# Altium schematic sheet STM32H733_PINOUT.SchDoc
size D; SheetNumber: 3; SheetTotal: 5
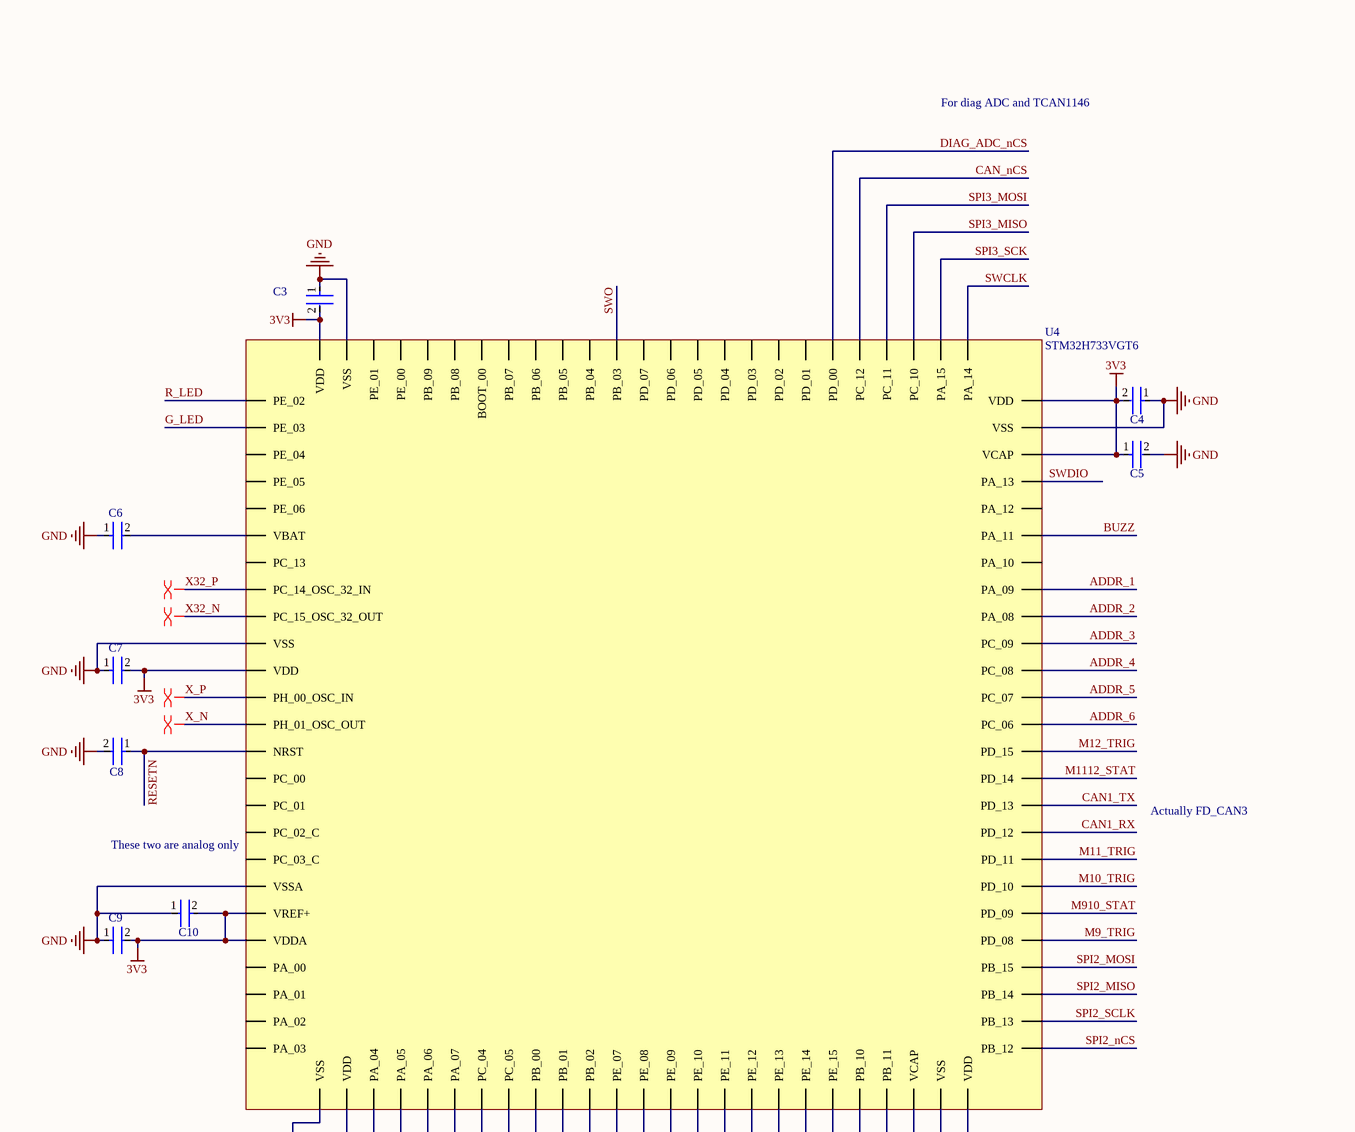
[diagram p0: STM32H733_PINOUT.SchDoc, top left]
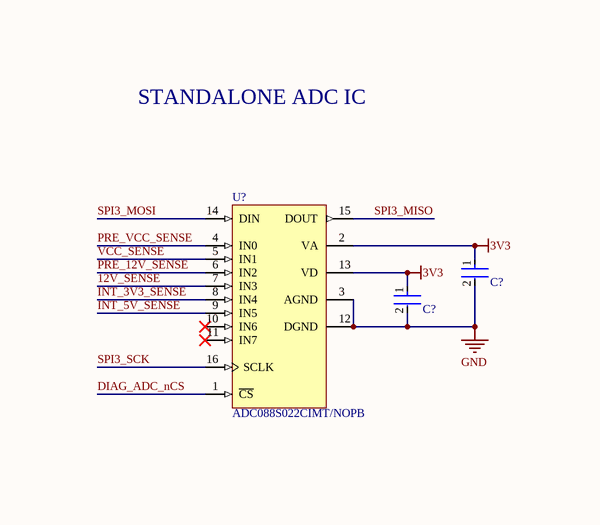
[diagram p1: STM32H733_PINOUT.SchDoc, top middle]
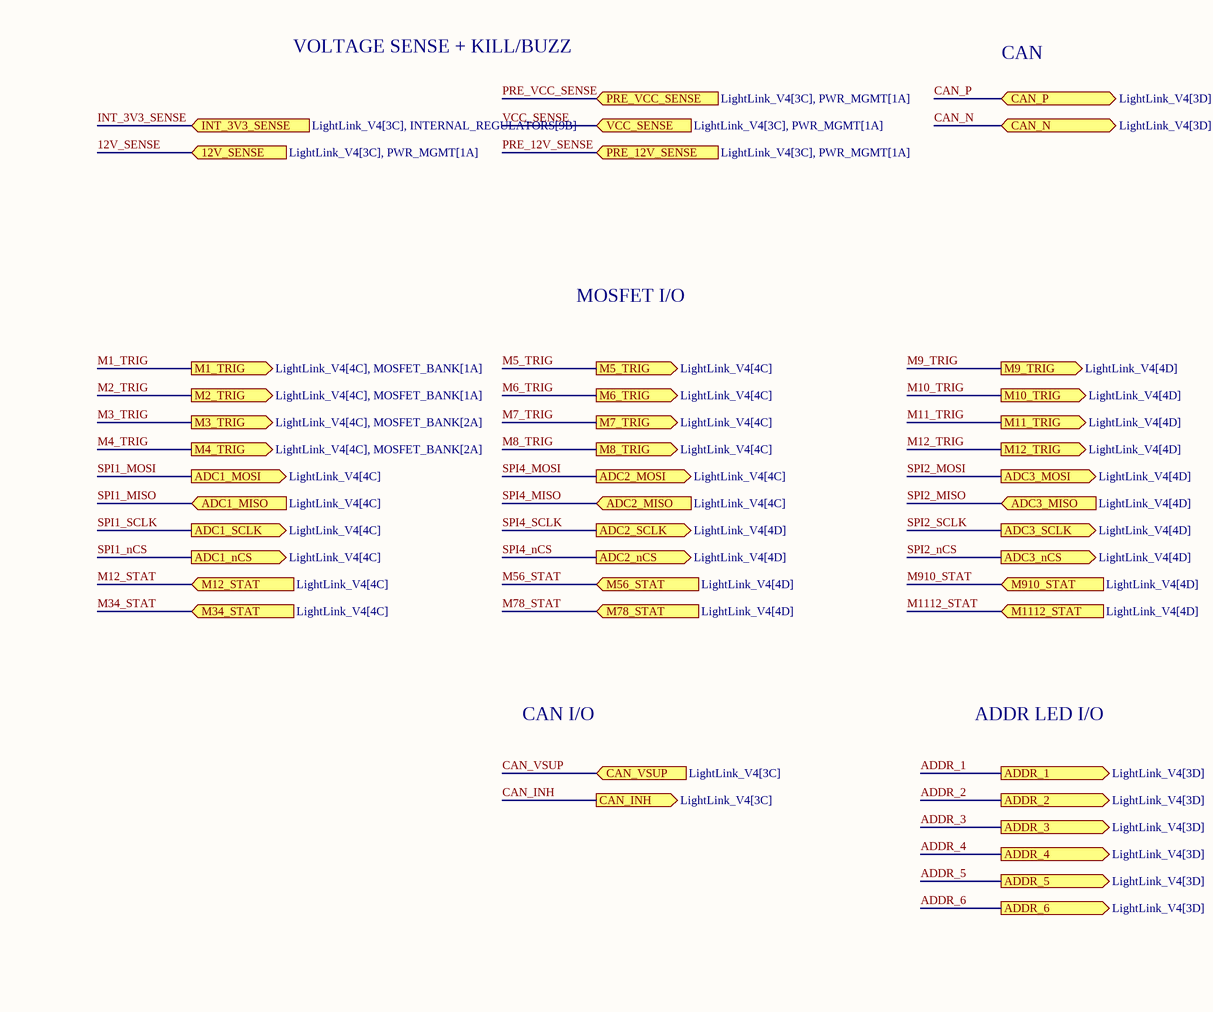
[diagram p2: STM32H733_PINOUT.SchDoc, top right]
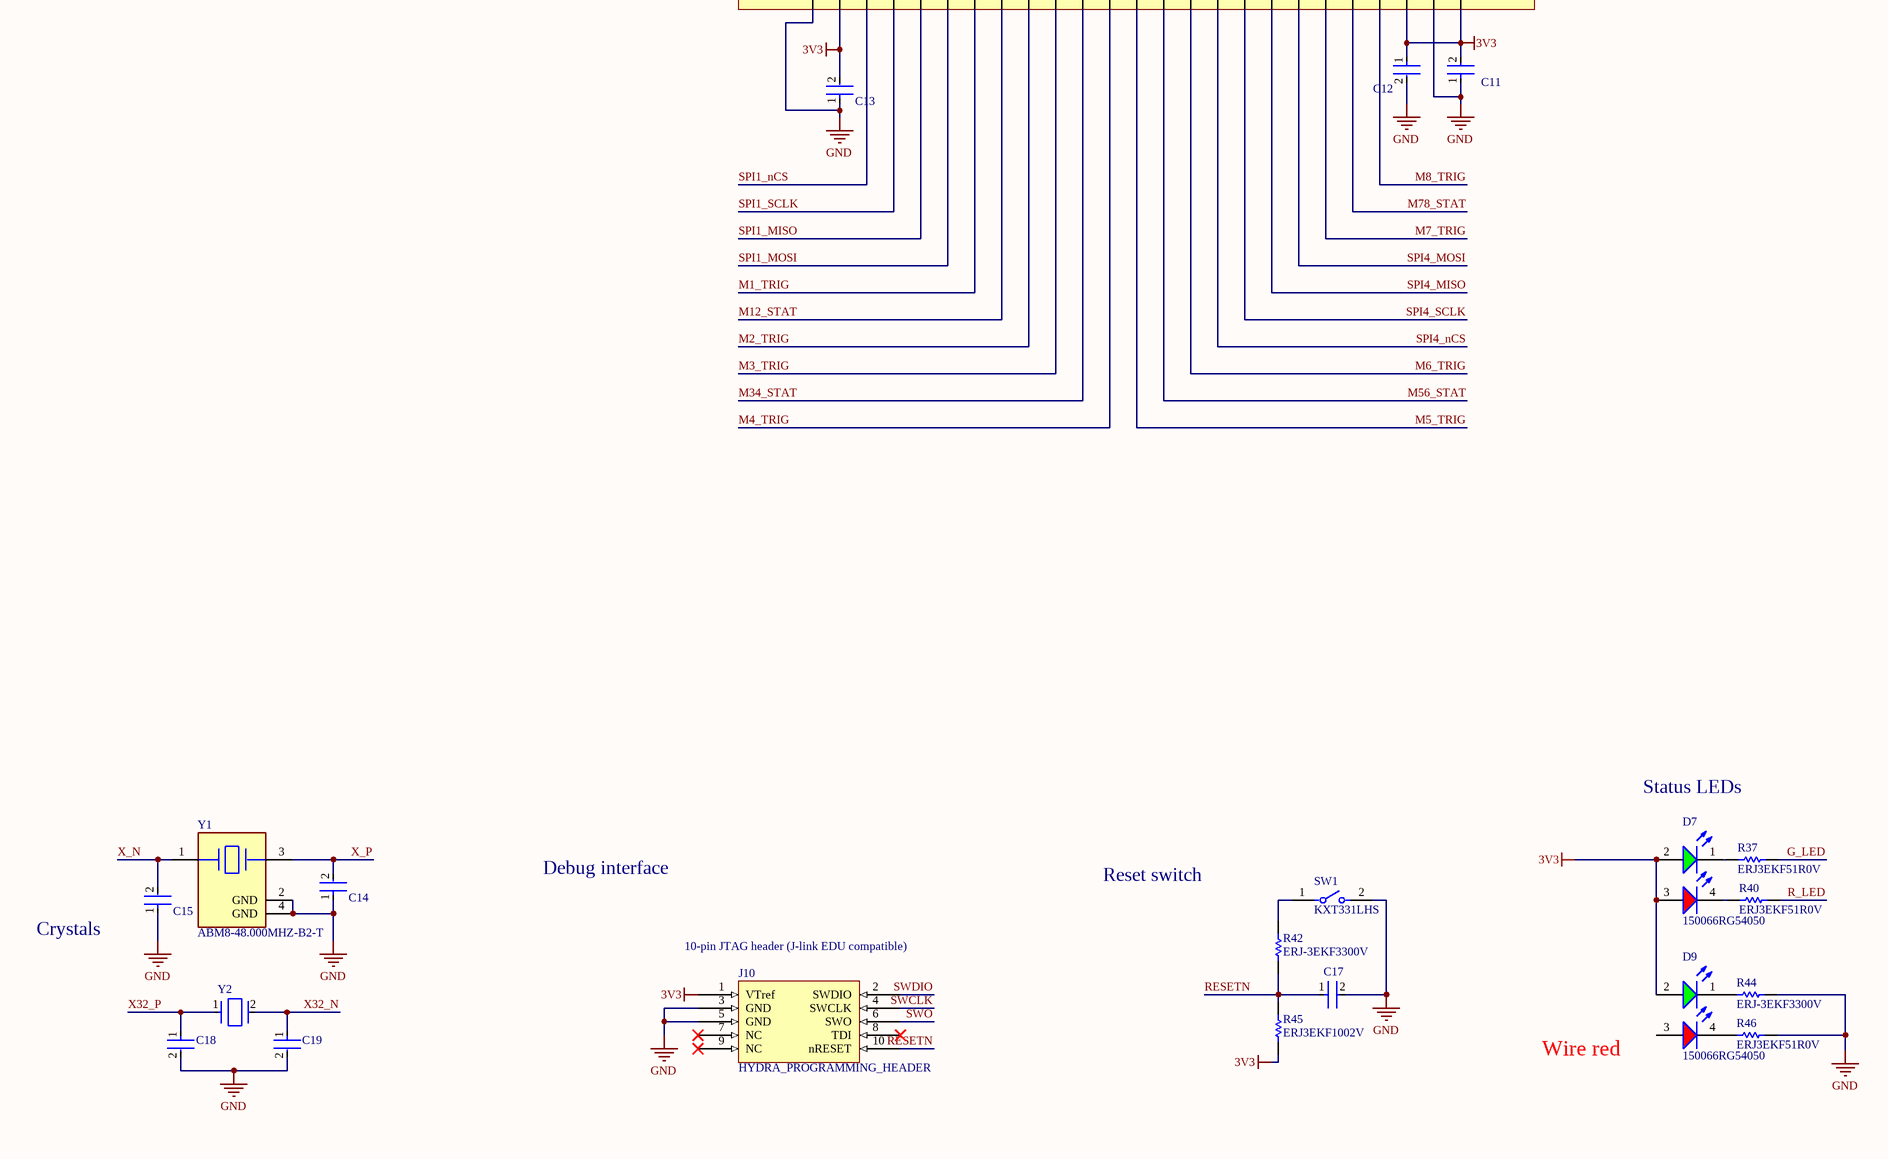
[diagram p3: STM32H733_PINOUT.SchDoc, bottom left]
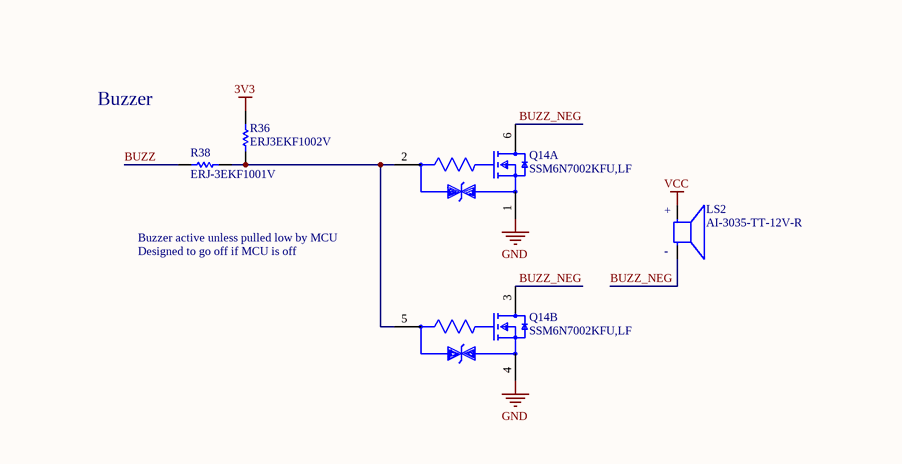
[diagram p4: STM32H733_PINOUT.SchDoc, bottom middle]
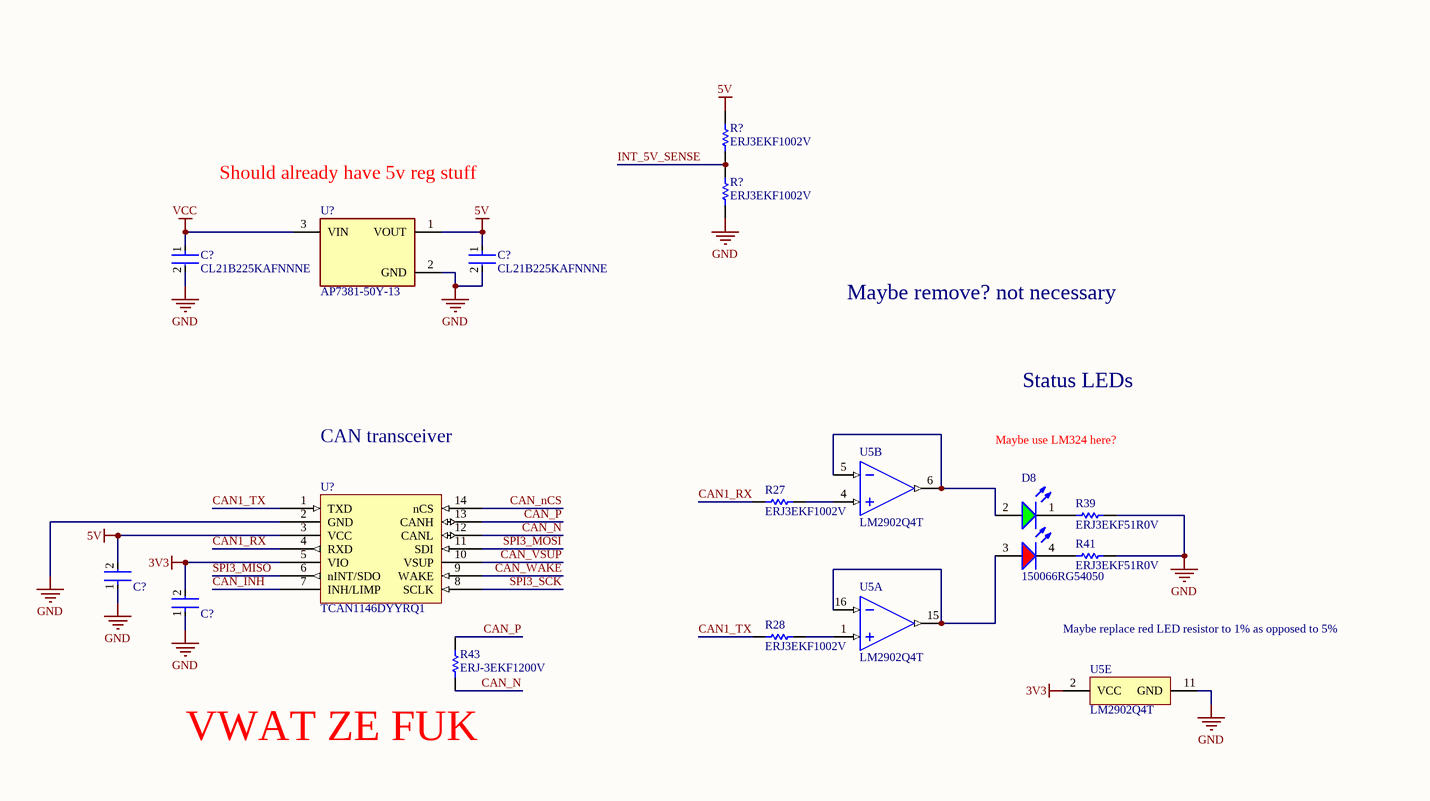
[diagram p5: STM32H733_PINOUT.SchDoc, bottom right]

## Parts
(Parts that share a designator on the sheet are numbered #1, #2 ... from top to bottom, then left to right.)
C3  C0402C104K8PACTU  [FP-C0402-BB-MFG]  (value not drawn)
C4  C0402C104K8PACTU  [FP-C0402-BB-MFG]  (value not drawn)
C5  C1005X7S1A225K050BC  [FP-C1005-050-0_15-0_1-MFG]  (value not drawn)
C6  C0402C104K8PACTU  [FP-C0402-BB-MFG]  (value not drawn)
C7  C0402C104K8PACTU  [FP-C0402-BB-MFG]  (value not drawn)
C8  C0402C104K8PACTU  [FP-C0402-BB-MFG]  (value not drawn)
C9  C0402C104K8PACTU  [FP-C0402-BB-MFG]  (value not drawn)
C10  GRM155R71C104KA88D  [FP-GRM15-MFG]  (value not drawn)
C11  C0402C104K8PACTU  [FP-C0402-BB-MFG]  (value not drawn)
C12  C1005X7S1A225K050BC  [FP-C1005-050-0_15-0_1-MFG]  (value not drawn)
C13  C0402C104K8PACTU  [FP-C0402-BB-MFG]  (value not drawn)
C14  08051A6R8CAT2A  [FP-0805-L_2_01_0_2-W_1_25-MFG]  (value not drawn)
C15  08051A6R8CAT2A  [FP-0805-L_2_01_0_2-W_1_25-MFG]  (value not drawn)
C17  C0402C104K8PACTU  [FP-C0402-BB-MFG]  (value not drawn)
C18  C0805C180J5GACTU  [FP-C0805C-DN-MFG]  (value not drawn)
C19  C0805C180J5GACTU  [FP-C0805C-DN-MFG]  (value not drawn)
C?#1  C0402C104K8PACTU  [FP-C0402-BB-MFG]  (value not drawn)
C?#2  C0402C104K8PACTU  [FP-C0402-BB-MFG]  (value not drawn)
C?#3  CL21B225KAFNNNE  [FP-0805-L_2_01_0_2-W_1_25-IPC_B]
C?#4  CL21B225KAFNNNE  [FP-0805-L_2_01_0_2-W_1_25-IPC_B]
C?#5  C0402C104K8PACTU  [FP-C0402-BB-MFG]  (value not drawn)
C?#6  C0402C104K8PACTU  [FP-C0402-BB-MFG]  (value not drawn)
D7  150066RG54050  [WL-SBCD_0606]
D8  150066RG54050  [WL-SBCD_0606]
D9  150066RG54050  [WL-SBCD_0606]
J10  HYDRA_PROGRAMMING_HEADER  [3220-10-0300-00-Footprint-1]
LS2  AI-3035-TT-12V-R  [AI-3035-TT-12V-R-Footprint-1]
Q14  SSM6N7002KFU,LF  [FP-SSOP6-P-0_65A-MFG]  (parts A,B of 2)
R27  ERJ3EKF1002V  [RESC1609X55X30LL15T15]
R28  ERJ3EKF1002V  [RESC1609X55X30LL15T15]
R36  ERJ3EKF1002V  [RESC1609X55X30LL15T15]
R37  ERJ3EKF51R0V  [RESC1608X55X30NL15T15]
R38  ERJ-3EKF1001V  [RESC1608X55X30LL15T15]
R39  ERJ3EKF51R0V  [RESC1608X55X30NL15T15]
R40  ERJ3EKF51R0V  [RESC1608X55X30NL15T15]
R41  ERJ3EKF51R0V  [RESC1608X55X30NL15T15]
R42  ERJ-3EKF3300V  [RESC1608X55X30LL15T15]
R43  ERJ-3EKF1200V  [RESC1609X55X30ML15T15]
R44  ERJ-3EKF3300V  [RESC1608X55X30LL15T15]
R45  ERJ3EKF1002V  [RESC1609X55X30LL15T15]
R46  ERJ3EKF51R0V  [RESC1608X55X30NL15T15]
R?#1  ERJ3EKF1002V  [RESC1609X55X30LL15T15]
R?#2  ERJ3EKF1002V  [RESC1609X55X30LL15T15]
SW1  KXT331LHS  [FP-KXT331LHS-MFG]
U4  STM32H733VGT6  [STM32H733VGT6-Footprint-1]
U5  LM2902Q4T  [LM2902Q4T-Footprint-1]  (parts A,B,E of 5)
U?#1  ADC088S022CIMT/NOPB  [MTC16_L]
U?#2  AP7381-50Y-13  [FP-SOT89-MFG]
U?#3  TCAN1146DYYRQ1  [TCAN1146DYYRQ1-Footprint-1]
Y1  ABM8-48.000MHZ-B2-T  [FP-ABM8-MFG]
Y2  ECS-.327-12.5-1210-TR  [FP-ECX-1210-MFG]  (value not drawn)

## Ports
12V_SENSE (in, see LightLink_V4[3C], PWR_MGMT[1A]), ADC1_MISO (in, see LightLink_V4[4C]), ADC1_MOSI (out, see LightLink_V4[4C]), ADC1_nCS (out, see LightLink_V4[4C]), ADC1_SCLK (out, see LightLink_V4[4C]), ADC2_MISO (in, see LightLink_V4[4C]), ADC2_MOSI (out, see LightLink_V4[4C]), ADC2_nCS (out, see LightLink_V4[4D]), ADC2_SCLK (out, see LightLink_V4[4D]), ADC3_MISO (in, see LightLink_V4[4D]), ADC3_MOSI (out, see LightLink_V4[4D]), ADC3_nCS (out, see LightLink_V4[4D]), ADC3_SCLK (out, see LightLink_V4[4D]), ADDR_1 (out, see LightLink_V4[3D]), ADDR_2 (out, see LightLink_V4[3D]), ADDR_3 (out, see LightLink_V4[3D]), ADDR_4 (out, see LightLink_V4[3D]), ADDR_5 (out, see LightLink_V4[3D]), ADDR_6 (out, see LightLink_V4[3D]), CAN_INH (out, see LightLink_V4[3C]), CAN_N (bidir, see LightLink_V4[3D]), CAN_P (bidir, see LightLink_V4[3D]), CAN_VSUP (in, see LightLink_V4[3C]), INT_3V3_SENSE (in, see LightLink_V4[3C], INTERNAL_REGULATORS[9B]), M1_TRIG (out, see LightLink_V4[4C], MOSFET_BANK[1A]), M2_TRIG (out, see LightLink_V4[4C], MOSFET_BANK[1A]), M3_TRIG (out, see LightLink_V4[4C], MOSFET_BANK[2A]), M4_TRIG (out, see LightLink_V4[4C], MOSFET_BANK[2A]), M5_TRIG (out, see LightLink_V4[4C]), M6_TRIG (out, see LightLink_V4[4C]), M7_TRIG (out, see LightLink_V4[4C]), M8_TRIG (out, see LightLink_V4[4C]), M9_TRIG (out, see LightLink_V4[4D]), M10_TRIG (out, see LightLink_V4[4D]), M11_TRIG (out, see LightLink_V4[4D]), M12_STAT (in, see LightLink_V4[4C]), M12_TRIG (out, see LightLink_V4[4D]), M34_STAT (in, see LightLink_V4[4C]), M56_STAT (in, see LightLink_V4[4D]), M78_STAT (in, see LightLink_V4[4D]), M910_STAT (in, see LightLink_V4[4D]), M1112_STAT (in, see LightLink_V4[4D]), PRE_12V_SENSE (in, see LightLink_V4[3C], PWR_MGMT[1A]), PRE_VCC_SENSE (in, see LightLink_V4[3C], PWR_MGMT[1A]), VCC_SENSE (in, see LightLink_V4[3C], PWR_MGMT[1A])

## Nets
3V3: C3.2 C4.2 C5.1 C7.2 C9.2 C10.2 C11.2 C12.1 C13.2 C?#1.1 C?#2.1 C?#6.2 D7.2(A) D7.3(A) D9.2(A) J10.1(VTref) R36.2 R45.1 U4.11(VDD) U4.20(VREF+) U4.21(VDDA) U4.27(VDD) U4.48(VCAP) U4.50(VDD) U4.73(VCAP) U4.75(VDD) U4.100(VDD) U5.2(VCC) U?#1.2(VA) U?#1.13(VD) U?#3.5(VIO)
5V: C?#4.1 C?#5.2 R?#1.2 U?#2.1(VOUT) U?#3.3(VCC)
GND: C3.1 C4.1 C5.2 C6.1 C7.1 C8.2 C9.1 C10.1 C11.1 C12.2 C13.1 C14.1 C15.1 C17.2 C18.2 C19.2 C?#1.2 C?#2.2 C?#3.2 C?#4.2 C?#5.1 C?#6.1 J10.3(GND) J10.5(GND) Q14.1(Source1) Q14.4(Source2) R39.2 R41.2 R44.2 R46.2 R?#2.1 SW1.2 U4.10(VSS) U4.19(VSSA) U4.26(VSS) U4.49(VSS) U4.74(VSS) U4.99(VSS) U5.11(GND) U?#1.3(AGND) U?#1.12(DGND) U?#2.2(GND) U?#3.2(GND) Y1.2(GND) Y1.4(GND)
VCC: C?#3.1 LS2.P U?#2.3(VIN)
12V_SENSE: U?#1.7(IN3) ; port 12V_SENSE
ADDR_1: U4.68(PA_09) ; port ADDR_1
ADDR_2: U4.67(PA_08) ; port ADDR_2
ADDR_3: U4.66(PC_09) ; port ADDR_3
ADDR_4: U4.65(PC_08) ; port ADDR_4
ADDR_5: U4.64(PC_07) ; port ADDR_5
ADDR_6: U4.63(PC_06) ; port ADDR_6
BUZZ: R38.1 U4.70(PA_11)
BUZZ_NEG: LS2.N Q14.3(Drain2) Q14.6(Drain1)
CAN1_RX: R27.1 U4.59(PD_12) U?#3.4(RXD)
CAN1_TX: R28.1 U4.60(PD_13) U?#3.1(TXD)
CAN_INH: U?#3.7(INH/LIMP) ; port CAN_INH
CAN_N: R43.1 U?#3.12(CANL) ; port CAN_N
CAN_nCS: U4.80(PC_12) U?#3.14(nCS)
CAN_P: R43.2 U?#3.13(CANH) ; port CAN_P
CAN_VSUP: U?#3.10(VSUP) ; port CAN_VSUP
CAN_WAKE: U?#3.9(WAKE)
DIAG_ADC_nCS: U4.81(PD_00) U?#1.1(~{CS})
G_LED: R37.2 U4.2(PE_03)
INT_3V3_SENSE: U?#1.8(IN4) ; port INT_3V3_SENSE
INT_5V_SENSE: R?#1.1 R?#2.2 U?#1.9(IN5)
M1_TRIG: U4.32(PC_04) ; port M1_TRIG
M2_TRIG: U4.34(PB_00) ; port M2_TRIG
M3_TRIG: U4.35(PB_01) ; port M3_TRIG
M4_TRIG: U4.37(PE_07) ; port M4_TRIG
M5_TRIG: U4.38(PE_08) ; port M5_TRIG
M6_TRIG: U4.40(PE_10) ; port M6_TRIG
M7_TRIG: U4.45(PE_15) ; port M7_TRIG
M8_TRIG: U4.47(PB_11) ; port M8_TRIG
M9_TRIG: U4.55(PD_08) ; port M9_TRIG
M10_TRIG: U4.57(PD_10) ; port M10_TRIG
M11_TRIG: U4.58(PD_11) ; port M11_TRIG
M12_STAT: U4.33(PC_05) ; port M12_STAT
M12_TRIG: U4.62(PD_15) ; port M12_TRIG
M34_STAT: U4.36(PB_02) ; port M34_STAT
M56_STAT: U4.39(PE_09) ; port M56_STAT
M78_STAT: U4.46(PB_10) ; port M78_STAT
M910_STAT: U4.56(PD_09) ; port M910_STAT
M1112_STAT: U4.61(PD_14) ; port M1112_STAT
PRE_12V_SENSE: U?#1.6(IN2) ; port PRE_12V_SENSE
PRE_VCC_SENSE: U?#1.4(IN0) ; port PRE_VCC_SENSE
R_LED: R40.2 U4.1(PE_02)
RESETN: C8.1 C17.1 J10.10(nRESET) R42.1 R45.2 U4.14(NRST)
SPI1_MISO: U4.30(PA_06) ; port ADC1_MISO
SPI1_MOSI: U4.31(PA_07) ; port ADC1_MOSI
SPI1_nCS: U4.28(PA_04) ; port ADC1_nCS
SPI1_SCLK: U4.29(PA_05) ; port ADC1_SCLK
SPI2_MISO: U4.53(PB_14) ; port ADC3_MISO
SPI2_MOSI: U4.54(PB_15) ; port ADC3_MOSI
SPI2_nCS: U4.51(PB_12) ; port ADC3_nCS
SPI2_SCLK: U4.52(PB_13) ; port ADC3_SCLK
SPI3_MISO: U4.78(PC_10) U?#1.15(DOUT) U?#3.6(nINT/SDO)
SPI3_MOSI: U4.79(PC_11) U?#1.14(DIN) U?#3.11(SDI)
SPI3_SCK: U4.77(PA_15) U?#1.16(SCLK) U?#3.8(SCLK)
SPI4_MISO: U4.43(PE_13) ; port ADC2_MISO
SPI4_MOSI: U4.44(PE_14) ; port ADC2_MOSI
SPI4_nCS: U4.41(PE_11) ; port ADC2_nCS
SPI4_SCLK: U4.42(PE_12) ; port ADC2_SCLK
SWCLK: J10.4(SWCLK) U4.76(PA_14)
SWDIO: J10.2(SWDIO) U4.72(PA_13)
SWO: J10.6(SWO) U4.89(PB_03)
VCC_SENSE: U?#1.5(IN1) ; port VCC_SENSE
X32_N: C19.1 U4.9(PC_15_OSC_32_OUT) Y2.2(Out/In)
X32_P: C18.1 U4.8(PC_14_OSC_32_IN) Y2.1(In/Out)
X_N: C15.2 U4.13(PH_01_OSC_OUT) Y1.1
X_P: C14.2 U4.12(PH_00_OSC_IN) Y1.3
NetC6_2: C6.2 U4.6(VBAT)
NetD7_1: D7.1(K) R37.1
NetD7_4: D7.4(K) R40.1
NetD8_1: D8.1(K) R39.1
NetD8_2: D8.2(A) U5.5(2IN-) U5.6(2OUT)
NetD8_3: D8.3(A) U5.15(1OUT) U5.16(1IN-)
NetD8_4: D8.4(K) R41.1
NetD9_1: D9.1(K) R44.1
NetD9_4: D9.4(K) R46.1
NetQ14_2: Q14.2(Gate1) Q14.5(Gate2) R36.1 R38.2
NetR27_2: R27.2 U5.4(2IN+)
NetR28_2: R28.2 U5.1(1IN+)
NetR42_2: R42.2 SW1.1

Not connected (* = marked no-connect by the designer): D9 3(A); J10 7(NC)* 8(TDI)* 9(NC)*; U4 3(PE_04) 4(PE_05) 5(PE_06) 7(PC_13) 15(PC_00) 16(PC_01) 17(PC_02_C) 18(PC_03_C) 22(PA_00) 23(PA_01) 24(PA_02) 25(PA_03) 69(PA_10) 71(PA_12) 82(PD_01) 83(PD_02) 84(PD_03) 85(PD_04) 86(PD_05) 87(PD_06) 88(PD_07) 90(PB_04) 91(PB_05) 92(PB_06) 93(PB_07) 94(BOOT_00) 95(PB_08) 96(PB_09) 97(PE_00) 98(PE_01); U?#1 10(IN6)* 11(IN7)*

## Layout directives
differential pair: X32_N, X32_P, X_N, X_P

## Notes on the sheet
- VOLTAGE SENSE + KILL/BUZZ
- CAN
- MOSFET I/O
- For diag ADC and TCAN1146
- CAN I/O
- ADDR LED I/O
- STANDALONE ADC IC
- Actually FD_CAN3
- (near U4) These two are analog only
- Should already have 5v reg stuff
- Maybe remove? not necessary
- Status LEDs
- Buzzer
- CAN transceiver
- Maybe use LM324 here?
- Debug interface
- Reset switch
- (near C15) Crystals
- (near J10) 10-pin JTAG header (J-link EDU compatible)
- Buzzer active unless pulled low by MCU
- Designed to go off if MCU is off
- Maybe replace red LED resistor to 1% as opposed to 5%
- Wire red
- (near R43) VWAT ZE FUK
- (in symbol CMP-00027-00003-1) +; -

## Library data of the parts
C3 C4 C6 C7 C9 C11 C13 = CMP-2008-02046-2: Manufacturer: Kemet; Material: Ceramic; Capacitance: 50 pF; Temperature Characteristic: X5R; Temperature Coefficient: 15%; Tolerance: 0.1; Voltage Rating: 10 V; Value: 50 pF; Package: C0402-BB; Temperature: -55°C to +125°C; ComponentLink2Description: Datasheet; Device Class L1: Passive Components; Height: 0.55mm; Lead Free: Yes; ComponentLink2URL: https://content.kemet.com/datasheets/KEM_C1002_X7R_SMD.pdf; Device Class L2: Capacitors; Temperature Range Low: -55°C; Temperature Range High: +125°C; RoHS: TRUE; Octopart: https://octopart.com/c0402c104k8pactu-kemet-140039; Automotive: No; Mouser Description: Capacitor 100 nF 10 VDC 0402; Category: Cap; Digikey Description: CAP CER 0.1UF 10V X5R 0402; Ipc Land Pattern Name: CAPC10050X50; Device Class L3: Ceramic Capacitors; Manufacturer Part Number: C0402C104K8PACTU
C5 C12 = CMP-08246-004344-1: CAP CER 2.2UF 10V X7S 0402; Dielectric Material: Ceramic; Tolerance: 10%; Mount: Surface Mount; Height: 0.5mm; Package Quantity: 1; Depth: 0.5mm; RoHS Compliant: Yes; Length: 1mm; Thickness: 0.022inch; Packaging: Tape and Reel; Capacitance: 2.2uF; Case Code (Imperial): 0402; Resistor Type: Ceramic; Dielectric: X7S; Case/Package: 0402; Min Operating Temperature: -55°C; Voltage Rating: 10V; Series: C; Weight: 2.3E-05oz; Width: 0.02inch; Voltage Rating (DC): 10V; Case Code (Metric): 1005; Max Operating Temperature: 125°C; Termination: SMD/SMT; Lead Free: Lead Free
C8 C17 C?#1 C?#2 C?#5 C?#6 = CMP-2008-02046-2: CAP CER 0.1UF 10V X5R 0402; Manufacturer: Kemet; Material: Ceramic; Capacitance: 0.10 μF; Temperature Coefficient: 15%; Tolerance: 0.1; Value: 0.10 μF; Package: C0402-BB; Temperature: -55°C to +125°C; ComponentLink2Description: Datasheet; Temperature Characteristic: X5R; Device Class L1: Passive Components; Height: 0.55mm; Lead Free: Yes; ComponentLink2URL: https://content.kemet.com/datasheets/KEM_C1002_X7R_SMD.pdf; Device Class L2: Capacitors; Temperature Range Low: -55°C; Temperature Range High: +125°C; RoHS: TRUE; Octopart: https://octopart.com/c0402c104k8pactu-kemet-140039; Automotive: No; Mouser Description: Capacitor 100 nF 10 VDC 0402; Category: Cap; Voltage Rating: 10 V; Digikey Description: CAP CER 0.1UF 10V X5R 0402; Ipc Land Pattern Name: CAPC10050X50; Device Class L3: Ceramic Capacitors; Manufacturer Part Number: C0402C104K8PACTU
C10 = CMP-2100-03641-2: CAP CER 0.1UF 16V X7R 0402; Manufacturer: Murata; Standoff Height: 0mm; Tolerance: 10%; Voltage Rating: 16Vdc; Material: Ceramic; Capacitance: 0.10μF; Value: 0.10μF; RoHS: TRUE; Manufacturer Part Number: GRM155R71C104KA88D; Temperature Characteristic: X7R; Octopart: https://octopart.com/grm155r71c104ka88d-murata-196880; Digikey Description: CAP CER 0.1UF 16V X7R 0402; Device Class L3: Ceramic Capacitors; Height: 0.55mm; ComponentLink2Description: Datasheet; Temperature Range Low: -55°C; Ipc Land Pattern Name: CAPC10050X219; ComponentLink2URL: https://search.murata.co.jp/Ceramy/image/img/A01X/G101/ENG/GRM155R71H471KA01-01A.pdf; Device Class L1: Passive Components; Lead Free: yes; Category: Cap; Package: GRM15; Temperature: -55°C to +125°C; Device Class L2: Capacitors; Temperature Range High: +125°C; Mouser Description: 0402 0.1 uF 16V ±10 % Tolerance X7R SMT Multilayer Ceramic Capacitor
C14 C15 = CMP-1036-00709-3: General Purpose Ceramic Capacitor, 0805, 6.8pF, 0.25pF, C0G, 30ppm/°C, 100V; Dissipation Factor: 10%; Insulation Resistance: 100GR; Tolerance: 5%; Max Operating Temperature: 125°C; RoHS Compliant: Yes; Capacitance: 6.8pF; Termination: SMD/SMT; Number of Pins: 2; Packaging: Tape and Reel; Mount: Surface Mount; Case Code (Metric): 2012; Case Code (Imperial): 0805; Height: 0.71mm; Min Operating Temperature: -55°C; Width: 0.049inch; Temperature Coefficient: 0ppm/°C; Length: 2.01mm; Dielectric: C0G; Series: -; Voltage Rating (DC): 100V; Dielectric Material: Ceramic; Depth: 1.25mm; Contact Plating: Tin; Voltage Rating: 100V; Thickness: 0.037inch; Case/Package: 0805; Lead Free: Lead Free; Radiation Hardening: No; Voltage: 100V; Construction: Flat; Package Quantity: 1; REACH SVHC: No SVHC
C18 C19 = CMP-2007-00302-2: CAP CER 18PF 50V C0G/NP0 0805; Manufacturer: KEMET; Temperature Characteristic: C0G; Tolerance: 0.05; Material: Ceramic; Temperature Coefficient: 30ppm/°C; Device Class L2: Capacitors; Capacitance: 18 pF; Temperature: -55°C to +125°C; Value: 18 pF; Package: C0805C-DN; Mouser Description: Cap Ceramic 18pF 50V C0G 5% SMD 0805 125C Paper T/R; Height: 0.88mm; ComponentLink2URL: https://content.kemet.com/datasheets/KEM_C1003_C0G_SMD.pdf; RoHS: TRUE; Octopart: https://octopart.com/c0805c180j5gactu-kemet-144810; ComponentLink2Description: Datasheet; Temperature Range High: +125°C; Digikey Description: CAP CER 18PF 50V C0G/NP0 0805; Device Class L1: Passive Components; Category: Cap; Automotive: No; Device Class L3: Ceramic Capacitors; Voltage Rating: 50 V; Temperature Range Low: -55°C; Ipc Land Pattern Name: CAPC200125X78; Lead Free: Yes; Manufacturer Part Number: C0805C180J5GACTU
C?#3 C?#4 = CMP-2007-04514-2: Voltage Rating (DC): 25V; Tolerance: 10%; Capacitance: 2.2uF; Dielectric: X7R; RoHS Compliant: Yes; Lead Free: Lead Free; Packaging: Tape and Reel; Case Code (Imperial): 0805; Case/Package: 0805; Contact Plating: Tin; Mount: Surface Mount; Construction: Flat; Voltage: 25V; REACH SVHC: No SVHC; Thickness: 0.06inch; Depth: 1.25mm; Max Operating Temperature: 125°C; Package Quantity: 3000; Width: 0.049inch; Height: 1.52mm; Case Code (Metric): 2012; Number of Pins: 2; Termination: SMD/SMT; Voltage Rating: 25V; Radiation Hardening: No; Series: FlEXITERM; Length: 2.01mm; Min Operating Temperature: -55°C
D7-D9 = CMP-004-00034-2: Led, Red/Grn, 180Mcd/230Mcd, 624Nm/525Nm Rohs Compliant: Yes
J10 = CMP-002-00075-1: CONN HEADER SMD 10POS 1.27MM (specifically compatible with J-Link EDU cable) PN: 3220-10-0300-00
LS2 = CMP-00027-00003-1: Audio Indicator 12V 12mA 110dBA 3.5KHz Resonant Frequency Thru-Hole
Q14 = CMP-35916-000009-1: MOSFET 2N-CH 60V 0.3A; Input Capacitance: 40pF; Continuous Drain Current (ID): 300mA; Max Power Dissipation: 285mW; FET Type: 2 N-Channel; Rds On Max: 1.5R; Mount: Surface Mount; Drain to Source Voltage (Vdss): 60V; Packaging: Tape and Reel
R27 R28 R36 R45 R?#1 R?#2 = CMP-1012-00623-3: Chip Resistor, 10 KOhm, +/- 1%, 0.1 W, -55 to 155 degC, 0603 (1608 Metric), RoHS, Tape and Reel; Manufacturer: Panasonic; Voltage Rating: 75V; Case\/Package: 0603; Power Rating: 100mW; Resistance: 10KOhm; Temperature Coefficient: 100ppm\/degreesC; Number of Pins: 2; Package Reference: 603; Depth: 0.8mm; Mount: SurfaceMount; Package Description: 2-Pin Surface Mount Device, Body 1.6 x 0.85 mm; Datasheet Version: 02/2017; Length: 1.6mm; Lead Free: LeadFree; Height: 0.45mm; Number of Terminations: 2; Max Power Dissipation: 100mW; Min Operating Temperature: -55degC; Datasheet URL: https://industrial.panasonic.com/cdbs/www-data/pdf/RDA0000/AOA0000C304.pdf; Termination: SMD/SMT; Case Code (Metric): 1608; Case Code (Imperial): 0603; Tolerance: 1%; Max Operating Temperature: 155degC; RoHSCompliant: true; Voltage Rating (DC): 75V; Radiation Hardening: No; Packaging: TapeandReel; Composition: ThickFilm; Mounting Technology: SurfaceMount; Manufacturer URL: http://www.panasonic.com/; Width: 0.031inch; REACH SVHC: NoSVHC; Contact Plating: Tin; Military Standard: Not; Package Quantity: 1
R37 R39-R41 R46 = CMP-2000-00547-1: Manufacturer: Panasonic; Part Number: ERJ3EKF51R0V
R38 = CMP-2000-00180-1: Manufacturer: Panasonic; Part Number: ERJ-3EKF1001V
R42 R44 = CMP-2000-00435-2: Chip Resistor, 330 Ohm, +/- 1%, 0.1 W, -55 to 155 degC, 0603 (1608 Metric), RoHS, Tape and Reel; Gender: Male; Mating Cycles: 10000; Current Rating: 500 mA; Voltage Rating: 10 V; REACH SVHC: No SVHC; PackageDescription: 2-Pin Surface Mount Device, Body 1.6 x 0.85 mm; Contact Finish: Gold; Pins: 8; ComponentLink1Description: Manufacturer URL; Packaging: Tape and Reel; Max Operating Temperature: 85 degC; Contact Material: Copper; Height: 1.45 mm; Width: 1.45 mm; DatasheetVersion: Apr-15; Package Quantity: 1500; Contact Plating: Gold; PackageReference: 0603; Mount: Surface Mount; Lead Pitch: 1.1 mm; Min Operating Temperature: -25 degC; ComponentLink1URL: http://www.panasonic.com/; ComponentLink2URL: http://industrial.panasonic.com/cdbs/www-data/pdf/RDA0000/AOA0000C86.pdf; Length: 13.7 mm; ComponentLink2Description: Datasheet; RoHSCompliant: true
R43 = CMP-2000-00213-2: Chip Resistor, 120 Ohm, +/- 1%, 0.1 W, -55 to 155 degC, 0603 (1608 Metric), RoHS, Tape and Reel; Manufacturer: Panasonic; Power Rating: 100mW; Voltage Rating (DC): 75V; Resistance: 120Ohm; Temperature Coefficient: 100ppm/degreesC; Number of Terminations: 2; Military Standard: Not; Tolerance: 1%; Min Operating Temperature: -55degC; Packaging: TapeandReel; Lead Free: LeadFree; Max Operating Temperature: 155degC; Manufacturer URL: http://www.panasonic.com/; Case Code (Imperial): 0603; REACH SVHC: NoSVHC; Width: 0.031inch; Datasheet URL: https://industrial.panasonic.com/cdbs/www-data/pdf/RDA0000/AOA0000C283.pdf; RoHSCompliant: true; Max Power Dissipation: 100mW; Termination: SMD/SMT; Package Reference: 0603; Height: 0.022inch; Depth: 0.8mm; Package Description: 2-Pin Surface Mount Device, Body 1.6 x 0.85 mm; Contact Plating: Tin; Length: 1.6mm; Package URL: http://www.st.com/st-web-ui/static/active/en/resource/technical/document/datasheet/CD00001320.pdf; Radiation Hardening: No; Package Quantity: 1; Number of Pins: 2; Datasheet Version: 42095.0; Voltage Rating: 75V; Composition: ThickFilm; Case/Package: 0603; Mount: SurfaceMount; Case Code (Metric): 1608
SW1 = CMP-10040-000029-1: SWITCH TACTILE SPST-NO 0.02A 15V; Operating Force: 240gf; Switch Travel: 0.13mm; Illumination Type: Non-Illuminated; Throw Configuration: SPST; Number of Ports: 1; Current Rating: 5A; Mechanical Life: 500000Cycles; Switch Function: Off-Mom; Connector Type: USB; Actuator Type: Standard; Gender: Receptacle; Number of Contacts: 24; Contact Plating: Gold; Insulation Color: Black; Min Operating Temperature: -40°C; Packaging: Tape and Reel; Flammability Rating: UL94 V-0; Max Operating Temperature: 85°C; Termination: Solder; Mount: Surface Mount
U4 = CMP-020-00024-1: MCU 32-bit ARM Cortex M7 RISC 1MB Flash 1.8V/2.5V/3.3V 100-Pin LQFP Tray
U5 = CMP-014-00004-1: LM2902 Series 30 V 1.3 MHz Low-Power Quad Operational Amplifier - QFN-16 (3x3)
U?#1 = CMP-0054-00372-2: 8-Channel, 50 kSPS to 200 kSPS, 8-Bit A/D Converter, 16-pin TSSOP, Pb-Free; Manufacturer: National Semiconductor; PackageTopMarking: NSUZXYTT*88S022*CIMT; CompType: ADC IC; PowerWise: Y; ComponentLink2URL: http://www.national.com/pf/AD/ADC088S022.html; RoHS: Y; PackageDescription: Molded TSSOP, Jedec, 5 x 4.4 x 0.9mm Body, 16 Lead, 0.65mm Pitch; DatasheetVersion: Feb-2010; PinCount: 16; ComponentLink1Description: ADC088S022 Datasheet; Code_JEDEC: MO-153-AB; ComponentLink3URL: http://www.national.com/packaging/folders/mtc16.html; PackageVersion: revD, Jun-2003; ComponentLink3Description: MTC16 Package Page; RevisionNote: Component URLs added; ComponentLink1URL: http://www.national.com/ds/AD/ADC088S022.pdf; ComponentLink2Description: ADC088S022 Web Page; PackageReference: MTC16
U?#2 = CMP-12756-000009-1: IC REG LINEAR 5V 150MA SOT89; Manufacturer: Diodes Inc.; Output Type: Fixed; Min Supply Voltage: 3.3V; Max Junction Temp: +125°C; Max Supply Voltage: 40V; Nominal Supply Current: 2.5-25uA; Number Of Outputs: 1; Dropout Voltage: 1000mV; Manufacturer Part Number: AP7381-50Y-13; RoHS: TRUE; Digikey Description: IC REG LINEAR 5V 150MA SOT89; Output Voltage: 5V; Footprint Url: https://www.diodes.com/assets/Package-Files/SOT89.pdf; Category: IC; Temperature: -40°C to +125°C; ComponentLink2Description: Datasheet; Package: SOT89; Temperature Range Low: -40°C; Temperature Range High: +125°C; ComponentLink2URL: https://www.diodes.com/assets/Datasheets/AP7381.pdf; Device Class L1: Integrated Circuits (ICs); Automotive: No; Output Current: 150mA; Ambient Temperature Range High: +85°C; Octopart: https://octopart.com/ap7381-50y-13-diodes+inc.-87775116; Lead Free: Yes; Device Class L2: Power Management ICs; Height: 1.6mm; Device Class L3: Voltage Regulators - Linear; Ambient Temperature Range Low: -40°C
U?#3 = CMP-015-00012-1: Automotive CAN FD transceiver with watchdog, bus diagnostics and partial networking via sele 14-SOT-23-THIN -40 to 150
Y1 = CMP-27762-011708-1: Crystal 48MHz ±20ppm 18pF SMD-4 3.2mm x 2.5mm; Series Resistance: 35R; Frequency Stability: 50ppm; Package Quantity: 1000; Packaging: Tape and Reel; Mount: Surface Mount; Length: 3.2mm; Load Capacitance: 18pF; Max Operating Temperature: 70°C; Operating Frequency: 48 MHz; RoHS Compliant: Yes; Series: ABM8; Frequency Tolerance: 20ppm; Lead Free: Lead Free; Min Operating Temperature: -20°C; Case/Package: CSMD; Number of Pins: 4; Height: 0.031inch; ESR (Equivalent Series Resistance): 35R; Frequency: 48MHz; Radiation Hardening: No; Width: 0.098inch; Tolerance: 20ppm; Termination: SMD/SMT; Depth: 2.5mm; Resistor Type: Ceramic; REACH SVHC: No SVHC
Y2 = CMP-40224-000006-1: CRYSTAL 32.7680KHZ 12.5PF SMD; Manufacturer: ECS International; Frequency: 32.768kHz; Esr: 90kΩ; Tolerance: 20ppm; Device Class L1: Passive Components; Load Capacitance: 12.5pF; Temperature: -40°C to +85°C; ComponentLink2URL: https://ecsxtal.com/store/pdf/ECX-1210.pdf; Series: ECX-1210; Octopart: https://octopart.com/ecs-.327-12.5-1210-tr-ecs+international-81221340; ComponentLink2Description: Datasheet; Temperature Range Low: -40°C; Digikey Description: CRYSTAL 32.7680KHZ 12.5PF SMD; Lead Free: Yes; RoHS: TRUE; Device Class L3: Crystals; Automotive: No; Category: Crys; Height: 0.5mm; Manufacturer Part Number: ECS-.327-12.5-1210-TR; Temperature Range High: +85°C; Device Class L2: Crystals / Oscillators; Package: ECX-1210